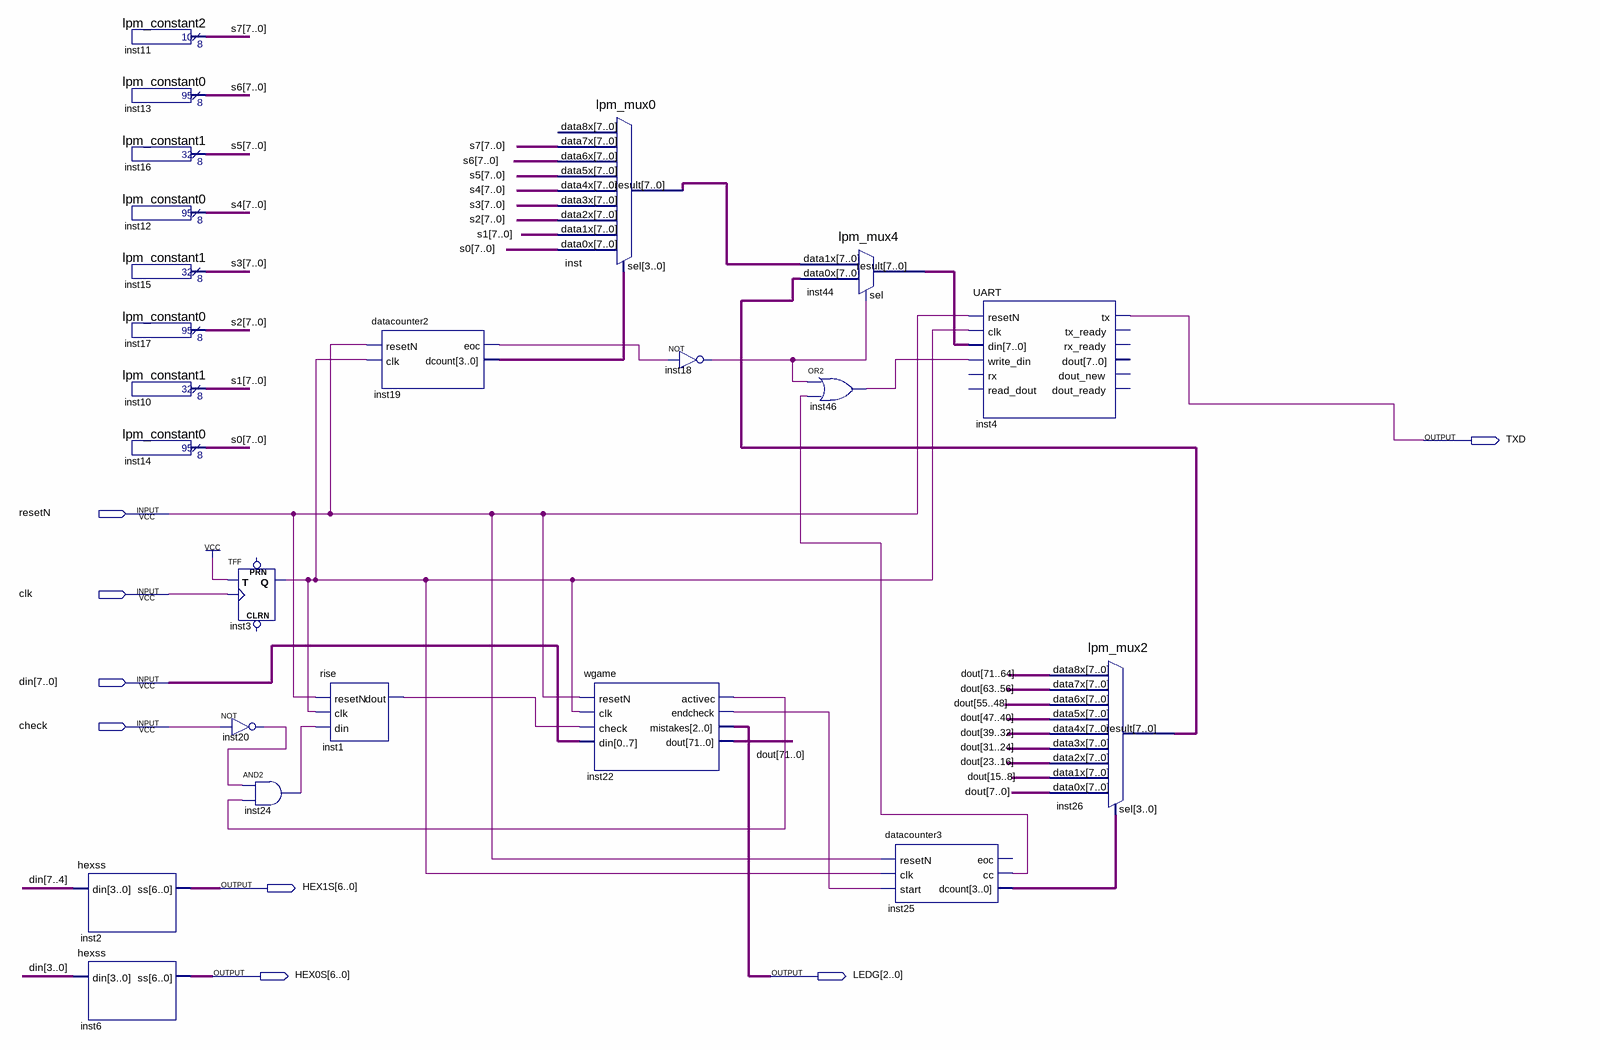
[diagram p0: schematic sheet]
// Quartus schematic now2.bdf as structural Verilog: 23 symbols, 8 pins
module now2 (
  input  resetN,
  input  clk,
  input  [7:0] din,
  input  check,
  output TXD,
  output [6:0] HEX1S,
  output [6:0] HEX0S,
  output [2:0] LEDG
);

  wire inst1_dout, inst3_q, inst18_out, inst19_eoc, inst20_out, inst22_activec, inst22_endcheck, inst24_out,
       inst25_cc, inst46_out;
  wire [3:0] inst19_dcount, inst25_dcount;
  wire [7:0] inst26_result, inst44_result, inst_result, s0, s1, s2, s3, s4, s5, s6, s7;
  wire [71:0] dout;

  hexss inst2 (.din(din[7:4]), .ss(HEX1S));
  hexss inst6 (.din(din[3:0]), .ss(HEX0S));
  lpm_constant2 inst11 (.result(s7));
  lpm_constant0 inst13 (.result(s6));
  lpm_constant1 inst16 (.result(s5));
  lpm_constant0 inst12 (.result(s4));
  lpm_constant1 inst15 (.result(s3));
  lpm_constant0 inst17 (.result(s2));
  lpm_constant1 inst10 (.result(s1));
  lpm_constant0 inst14 (.result(s0));
  TFF inst3 (.T(1'b1), .CLK(clk), .Q(inst3_q));  // open: PRN, CLRN
  not inst20 (inst20_out, check);
  and inst24 (inst24_out, inst20_out, inst22_activec);
  rise inst1 (.resetN(resetN), .clk(inst3_q), .din(inst24_out), .dout(inst1_dout));
  datacounter2 inst19 (.resetN(resetN), .clk(inst3_q), .eoc(inst19_eoc), .dcount(inst19_dcount));
  lpm_mux0 inst (
    .data7x(s7), .data6x(s6), .data5x(s5), .data4x(s4), .data3x(s3), .data2x(s2), .data1x(s1), .data0x(s0),
    .sel(inst19_dcount), .result(inst_result));  // open: data8x
  wgame inst22 (
    .resetN(resetN), .clk(inst3_q), .check(inst1_dout), .din(din), .activec(inst22_activec),
    .endcheck(inst22_endcheck), .mistakes(LEDG), .dout(dout));
  not inst18 (inst18_out, inst19_eoc);
  lpm_mux4 inst44 (.data1x(inst_result), .data0x(inst26_result), .sel(inst18_out), .result(inst44_result));
  or inst46 (inst46_out, inst18_out, inst25_cc);
  datacounter3 inst25 (
    .resetN(resetN), .clk(inst3_q), .start(inst22_endcheck), .cc(inst25_cc), .dcount(inst25_dcount));  // open: eoc
  UART inst4 (
    .resetN(resetN), .clk(inst3_q), .din(inst44_result), .write_din(inst46_out), .tx(TXD));  // open: rx, read_dout, tx_ready, rx_ready, dout, dout_new, dout_ready
  lpm_mux2 inst26 (
    .data8x(dout[71:64]), .data7x(dout[63:56]), .data6x(dout[55:48]), .data5x(dout[47:40]),
    .data4x(dout[39:32]), .data3x(dout[31:24]), .data2x(dout[23:16]), .data1x(dout[15:8]),
    .data0x(dout[7:0]), .sel(inst25_dcount), .result(inst26_result));
endmodule
